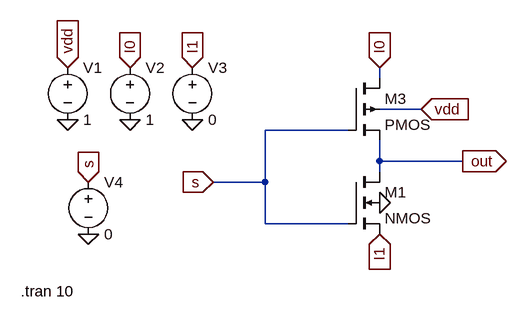
[diagram p0: schematic gdi_based_mux.asc]
gdi_based_mux.asc, the LTspice schematic file:
Version 4
SHEET 1 880 680
WIRE 256 48 256 32
WIRE 320 96 256 96
WIRE 208 128 80 128
WIRE 256 176 256 144
WIRE 384 176 256 176
WIRE 256 192 256 176
WIRE 80 208 80 128
WIRE 80 208 0 208
WIRE 80 272 80 208
WIRE 208 272 80 272
FLAG 0 208 s
IOPIN 0 208 In
FLAG 256 32 I0
IOPIN 256 32 In
FLAG 256 288 I1
IOPIN 256 288 In
FLAG 384 176 out
IOPIN 384 176 Out
FLAG 256 240 0
FLAG 320 96 vdd
IOPIN 320 96 In
FLAG -224 112 0
FLAG -128 112 0
FLAG -32 112 0
FLAG -192 288 0
FLAG -224 32 vdd
IOPIN -224 32 In
FLAG -128 32 I0
IOPIN -128 32 In
FLAG -32 32 I1
IOPIN -32 32 In
FLAG -192 208 s
IOPIN -192 208 In
SYMBOL nmos4 208 192 R0
SYMATTR InstName M1
SYMBOL pmos4 208 48 R0
SYMATTR InstName M3
SYMBOL voltage -224 16 R0
WINDOW 123 0 0 Left 0
WINDOW 39 0 0 Left 0
SYMATTR InstName V1
SYMATTR Value 1
SYMBOL voltage -128 16 R0
WINDOW 123 0 0 Left 0
WINDOW 39 0 0 Left 0
SYMATTR InstName V2
SYMATTR Value 1
SYMBOL voltage -32 16 R0
WINDOW 123 0 0 Left 0
WINDOW 39 0 0 Left 0
SYMATTR InstName V3
SYMATTR Value 0
SYMBOL voltage -192 192 R0
WINDOW 123 0 0 Left 0
WINDOW 39 0 0 Left 0
SYMATTR InstName V4
SYMATTR Value 0
TEXT -296 376 Left 2 !.tran 10

The netlist it stands for:
* gdi_based_mux.asc
M1 out s I1 0 NMOS
M3 I0 s out vdd PMOS
V1 vdd 0 1
V2 I0 0 1
V3 I1 0 0
V4 s 0 0
.model NMOS NMOS
.model PMOS PMOS
.lib standard.mos
.tran 10
.backanno
.end